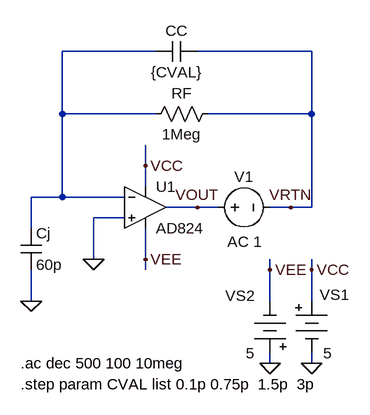
[diagram p0: schematic fig-03-03-11.asc]
fig-03-03-11.asc, the LTspice schematic file:
Version 4
SHEET 1 880 680
WIRE 224 -64 80 -64
WIRE 464 -64 288 -64
WIRE 80 32 80 -64
WIRE 224 32 80 32
WIRE 464 32 464 -64
WIRE 464 32 304 32
WIRE 208 112 208 80
WIRE 208 144 208 112
WIRE 80 160 80 32
WIRE 80 160 32 160
WIRE 176 160 80 160
WIRE 288 176 240 176
WIRE 320 176 288 176
WIRE 432 176 400 176
WIRE 464 176 464 32
WIRE 464 176 432 176
WIRE 176 192 128 192
WIRE 32 208 32 160
WIRE 128 256 128 192
WIRE 208 256 208 208
WIRE 208 272 208 256
WIRE 400 272 400 256
WIRE 464 272 464 256
WIRE 32 320 32 272
WIRE 400 320 400 272
WIRE 464 320 464 272
WIRE 400 416 400 400
WIRE 464 416 464 400
FLAG 128 256 0
FLAG 400 416 0
FLAG 464 416 0
FLAG 400 272 VEE
FLAG 464 272 VCC
FLAG 208 112 VCC
FLAG 208 256 VEE
FLAG 32 320 0
FLAG 288 176 VOUT
FLAG 432 176 VRTN
SYMBOL res 320 16 R90
WINDOW 0 0 56 VBottom 2
WINDOW 3 32 56 VTop 2
SYMATTR InstName RF
SYMATTR Value 1Meg
SYMBOL Misc\\battery 464 304 R0
WINDOW 0 13 6 Left 2
WINDOW 3 18 96 Left 2
WINDOW 123 0 0 Left 0
WINDOW 39 0 0 Left 0
SYMATTR InstName VS1
SYMATTR Value 5
SYMBOL Misc\\battery 400 416 R180
WINDOW 0 24 104 Left 2
WINDOW 3 24 16 Left 2
WINDOW 123 0 0 Left 0
WINDOW 39 0 0 Left 0
SYMATTR InstName VS2
SYMATTR Value 5
SYMBOL Opamps\\AD824 208 112 R0
SYMATTR InstName U1
SYMBOL cap 16 208 R0
SYMATTR InstName Cj
SYMATTR Value 60p
SYMBOL cap 288 -80 R90
WINDOW 0 0 32 VBottom 2
WINDOW 3 32 32 VTop 2
SYMATTR InstName CC
SYMATTR Value {CVAL}
SYMBOL voltage 304 176 R270
WINDOW 0 32 56 VTop 2
WINDOW 3 -32 56 VBottom 2
WINDOW 123 -37 57 VBottom 2
WINDOW 39 0 0 Left 0
SYMATTR InstName V1
SYMATTR Value ""
SYMATTR Value2 AC 1
TEXT 16 416 Left 2 !.ac dec 500 100 10meg
TEXT 16 448 Left 2 !.step param CVAL list 0.1p 0.75p  1.5p  3p

The netlist it stands for:
* fig-03-03-11.asc
RF VRTN N001 1Meg
VS1 VCC 0 5
VS2 0 VEE 5
XU1 0 N001 VCC VEE VOUT AD824  ; pins In+ In- V+ V- OUT
Cj N001 0 60p
CC VRTN N001 {CVAL}
V1 VOUT VRTN AC 1
.ac dec 500 100 10meg
.step param CVAL list 0.1p 0.75p  1.5p  3p
.backanno
.end